# Altium schematic sheet 7.4V.schdoc
size 349 x 134 mm; SheetNumber: 2; SheetTotal: 5
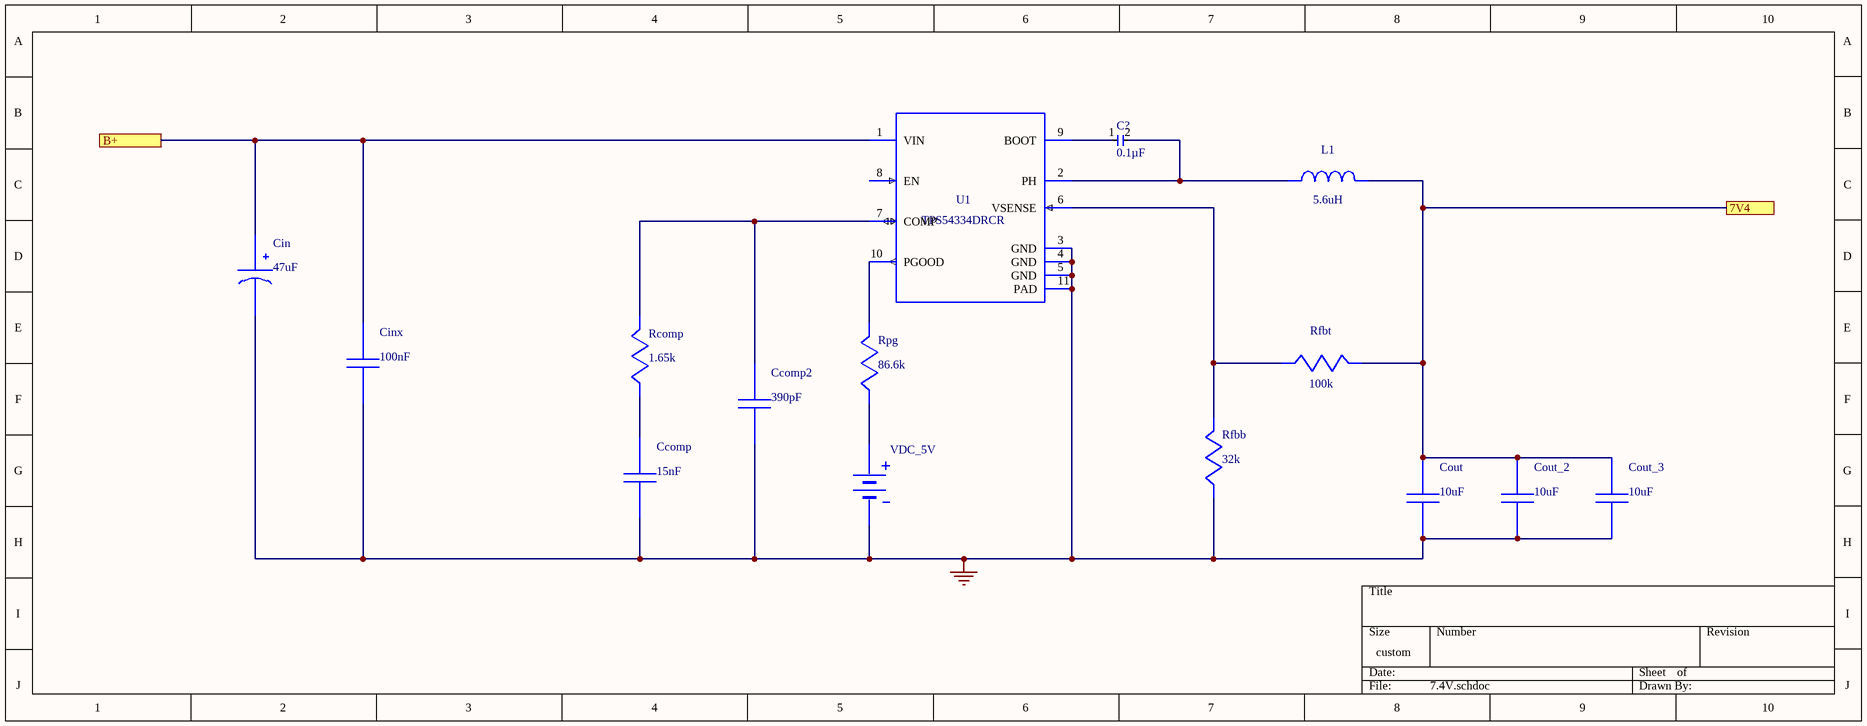
[diagram p0: 7.4V.schdoc]

## Parts
C?  0.1µF
Ccomp  value 15nF  (hidden comment: CGA4F2C0G1H153J085AA)
Ccomp2  value 390pF  (hidden comment: GRM1555C1H391JA01J)
Cin  value 47uF  (hidden comment: EEE-FC1H470P)
Cinx  value 100nF  (hidden comment: C0805C104M5RACTU)
Cout  value 10uF  (hidden comment: C0805C106K8PACTU)
Cout_2  value 10uF  (hidden comment: C0805C106K8PACTU)
Cout_3  value 10uF  (hidden comment: C0805C106K8PACTU)
L1  value 5.6uH  (hidden comment: NPI54C5R6MTRF)
Rcomp  value 1.65k  (hidden comment: CRCW04021K65FKED)
Rfbb  value 32k  (hidden comment: TNPW040232K0BEED)
Rfbt  value 100k  (hidden comment: CRCW0402100KFKED)
Rpg  value 86.6k  (hidden comment: RC0201FR-0786K6L)
U1  TPS54334DRCR
VDC_5V  WB_PRIM_DC_VOLTAGE_SOURCE  (value not drawn)

## Ports
7V4, B+

## Nets
0: Ccomp.2 Ccomp2.2 Cin.2(-) Cinx.2 Cout.2 Cout_2.2 Cout_3.2 Rfbb.1 U1.3(GND) U1.4(GND) U1.5(GND) U1.11(PAD) VDC_5V.2(-)
7V4: Cout.1 Cout_2.1 Cout_3.1 L1.2 Rfbt.1 ; port 7V4
B+: Cin.1(+) Cinx.1 U1.1(VIN) ; port B+
NetC?_1: C?.1 U1.9(BOOT)
NetC?_2: C?.2 L1.1 U1.2(PH)
NetCcomp2_1: Ccomp2.1 Rcomp.1 U1.7(COMP)
NetCcomp_1: Ccomp.1 Rcomp.2
NetRfbb_2: Rfbb.2 Rfbt.2 U1.6(VSENSE)
NetRpg_1: Rpg.1 U1.10(PGOOD)
NetRpg_2: Rpg.2 VDC_5V.1(+)

Not connected (* = marked no-connect by the designer): U1 8(EN)

## Library data of the parts
C? = C0805C104K5RACTU: Cap Ceramic 0.1uF 50V X7R 10% SMD 2.0 x 1.2 mm 125 C Paper T/R; Manufacturer: KEMET; Capacitance: 100nF; Voltage: 500V; Supplier 1: Farnell; Manufacturer Part Number: C0805C104K5RACTU; RoHS: Yes; Category: Ceramic Capacitors; Stock 1: 148517; Pricing 1: 10=0,07810, 100=0,05810, 500=0,03910, 1000=0,03450, 2000=0,03090 (GBP); Mount: Surface Mount,PCB; Case/Package: 0805; Number of Pins: 2; Case Code (Imperial): 0805; Case Code (Metric): 2012; Contact Plating: Tin,Matte; Dielectric Material: Ceramic; Min Operating Temperature: -55°C; Max Operating Temperature: 125°C; Tolerance: 10%; Dielectric: X7R; Package Quantity: 4000; Voltage Rating: 50V; Packaging: Tape and Reel; Voltage Rating (DC): 50V; Termination: SMD/SMT; Series: C0805C; Construction: Flat; Length: 2mm; Width: 1.2mm; Height: 0.9mm; Depth: 1.25mm; Lead Pitch: 0.75mm; Thickness: 0.035inch; Radiation Hardening: No; RoHS Compliant: Yes; REACH SVHC: No SVHC; ComponentLink1URL: https://datasheet.ciiva.com/14589/70095383-14589048.pdf?src-supplier=Allied+Electronics; ComponentLink1Description: https://datasheet.ciiva.com/14589/70095383-14589048.pdf?src-supplier=Allied+Electronics; ComponentLink2URL: https://datasheet.ciiva.com/28682/1851736-28682232.pdf?src-supplier=Element14; ComponentLink2Description: https://datasheet.ciiva.com/28682/1851736-28682232.pdf?src-supplier=Element14; ComponentLink3URL: https://datasheet.ciiva.com/32431/slceramic-chip-condensers-e-32431755.pdf?src-supplier=Distrelec; ComponentLink3Description: https://datasheet.ciiva.com/32431/slceramic-chip-condensers-e-32431755.pdf?src-supplier=Distrelec; ComponentLink4URL: https://datasheet.ciiva.com/18410/70095383-18410815.pdf?src-supplier=Allied+Electronics; ComponentLink4Description: https://datasheet.ciiva.com/18410/70095383-18410815.pdf?src-supplier=Allied+Electronics; Supplier Part Number 1: 1414664
Ccomp = CGA4F2C0G1H153J085AA: CGA4F2C0G1H153J0; Manufacturer Name: TDK; PackageReference: CGA4F2C0G1H153J085AA; Manufacturer Part Number: CGA4F2C0G1H153J085AA
Ccomp2 = GRM1555C1H391JA01J: GRM1555C1H391JA0; Manufacturer Name: MuRata; PackageReference: GRM1555C1H391JA01J; Manufacturer Part Number: GRM1555C1H391JA01J
Cin = EEE-FC1H470P: Manufacturer Name: Panasonic; PackageReference: EEE-FC1H470P; Manufacturer Part Number: EEE-FC1H470P
Cinx = C0805C104M5RACTU: Manufacturer Name: Kemet; PackageReference: C0805C104M5RACTU; Manufacturer Part Number: C0805C104M5RACTU
Cout Cout_2 Cout_3 = C0805C106K8PACTU: Manufacturer Name: Kemet; PackageReference: C0805C106K8PACTU; Manufacturer Part Number: C0805C106K8PACTU
L1 = NPI54C5R6MTRF: Manufacturer Name: NIC Components; PackageReference: NPI54C5R6MTRF; Manufacturer Part Number: NPI54C5R6MTRF
Rcomp = CRCW04021K65FKED: Manufacturer Name: Vishay-Dale; PackageReference: CRCW04021K65FKED; Manufacturer Part Number: CRCW04021K65FKED
Rfbb = TNPW040232K0BEED: Manufacturer Name: Vishay-Dale; PackageReference: TNPW040232K0BEED; Manufacturer Part Number: TNPW040232K0BEED
Rfbt = CRCW0402100KFKED: Manufacturer Name: Vishay-Dale; PackageReference: CRCW0402100KFKED; Manufacturer Part Number: CRCW0402100KFKED
Rpg = RC0201FR-0786K6L: Manufacturer Name: Yageo; PackageReference: RC0201FR-0786K6L; Manufacturer Part Number: RC0201FR-0786K6L
U1 = TPS54334DRCR: Manufacturer Name: Texas Instruments; PackageReference: TPS54334DRCR; Manufacturer Part Number: TPS54334DRCR; Value: N/A
VDC_5V = WB_PRIM_DC_VOLTAGE_SOURCE: WB_PRIM_DC_VOLTA; PackageReference: WB_PRIM_DC_VOLTAGE_SOURCE; Manufacturer Part Number: WB_PRIM_DC_VOLTAGE_SOURCE; Manufacturer Name: WB_PRIM_DC_VOLTAGE_SOURCE; Value: N/A